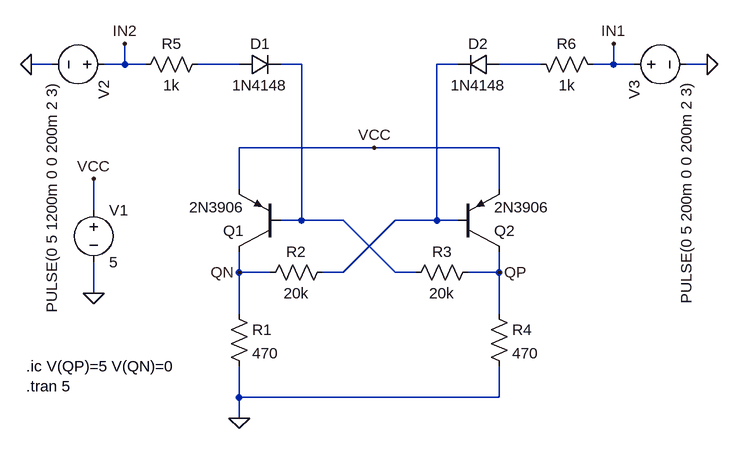
[diagram p0: schematic bistable_pnp.asc]
bistable_pnp.asc, the LTspice schematic file:
Version 4
SHEET 1 880 740
WIRE -256 -80 -288 -80
WIRE -144 -80 -144 -112
WIRE -144 -80 -176 -80
WIRE -112 -80 -144 -80
WIRE 32 -80 -32 -80
WIRE 128 -80 96 -80
WIRE 368 -80 336 -80
WIRE 496 -80 432 -80
WIRE 608 -80 608 -112
WIRE 608 -80 576 -80
WIRE 640 -80 608 -80
WIRE 752 -80 720 -80
WIRE 240 48 32 48
WIRE 432 48 240 48
WIRE 32 112 32 48
WIRE 432 112 432 48
WIRE -192 144 -192 96
WIRE 128 160 128 -80
WIRE 128 160 96 160
WIRE 192 160 128 160
WIRE 336 160 336 -80
WIRE 336 160 272 160
WIRE 368 160 336 160
WIRE 32 240 32 208
WIRE 80 240 32 240
WIRE 192 240 272 160
WIRE 192 240 160 240
WIRE 272 240 192 160
WIRE 304 240 272 240
WIRE 432 240 432 208
WIRE 432 240 384 240
WIRE -192 272 -192 224
WIRE 32 304 32 240
WIRE 432 304 432 240
WIRE 32 432 32 384
WIRE 432 432 432 384
WIRE 432 432 32 432
WIRE 32 464 32 432
FLAG 32 464 0
FLAG 240 48 VCC
FLAG 32 240 QN
FLAG 432 240 QP
FLAG -192 272 0
FLAG -192 96 VCC
FLAG -288 -80 0
FLAG -144 -112 IN2
FLAG 752 -80 0
FLAG 608 -112 IN1
SYMBOL res 16 288 R0
SYMATTR InstName R1
SYMATTR Value 470
SYMBOL res 176 224 R90
WINDOW 0 0 56 VBottom 2
WINDOW 3 32 56 VTop 2
SYMATTR InstName R2
SYMATTR Value 20k
SYMBOL res 400 224 R90
WINDOW 0 0 56 VBottom 2
WINDOW 3 32 56 VTop 2
SYMATTR InstName R3
SYMATTR Value 20k
SYMBOL res 416 288 R0
SYMATTR InstName R4
SYMATTR Value 470
SYMBOL voltage -192 128 R0
WINDOW 123 0 0 Left 0
WINDOW 39 0 0 Left 0
SYMATTR InstName V1
SYMATTR Value 5
SYMBOL pnp 96 208 R180
SYMATTR InstName Q1
SYMATTR Value 2N3906
SYMBOL pnp 368 208 M180
SYMATTR InstName Q2
SYMATTR Value 2N3906
SYMBOL diode 32 -64 R270
WINDOW 0 32 32 VTop 2
WINDOW 3 0 32 VBottom 2
SYMATTR InstName D1
SYMATTR Value 1N4148
SYMBOL res -16 -96 R90
WINDOW 0 0 56 VBottom 2
WINDOW 3 32 56 VTop 2
SYMATTR InstName R5
SYMATTR Value 1k
SYMBOL voltage -160 -80 R90
WINDOW 123 0 0 Left 0
WINDOW 39 0 0 Left 0
SYMATTR InstName V2
SYMATTR Value PULSE(0 5 1200m 0 0 200m 2 3)
SYMBOL diode 432 -64 M270
WINDOW 0 32 32 VTop 2
WINDOW 3 0 32 VBottom 2
SYMATTR InstName D2
SYMATTR Value 1N4148
SYMBOL res 480 -96 M90
WINDOW 0 0 56 VBottom 2
WINDOW 3 32 56 VTop 2
SYMATTR InstName R6
SYMATTR Value 1k
SYMBOL voltage 624 -80 M90
WINDOW 123 0 0 Left 0
WINDOW 39 0 0 Left 0
SYMATTR InstName V3
SYMATTR Value PULSE(0 5 200m 0 0 200m 2 3)
TEXT -296 384 Left 2 !.ic V(QP)=5 V(QN)=0\n.tran 5

The netlist it stands for:
* bistable_pnp.asc
R1 QN 0 470
R2 N003 QN 20k
R3 QP N002 20k
R4 QP 0 470
V1 VCC 0 5
Q1 QN N002 VCC 0 2N3906
Q2 QP N003 VCC 0 2N3906
D1 N001 N002 1N4148
R5 N001 IN2 1k
V2 IN2 0 PULSE(0 5 1200m 0 0 200m 2 3)
D2 N004 N003 1N4148
R6 N004 IN1 1k
V3 IN1 0 PULSE(0 5 200m 0 0 200m 2 3)
.model D D
.lib standard.dio
.model NPN NPN
.model PNP PNP
.lib standard.bjt
.ic V(QP)=5 V(QN)=0
.tran 5
.backanno
.end